# Altium schematic sheet Main_Connectors.SchDoc
size A; DocumentNumber: D_1; SheetNumber: 1; SheetTotal: 21
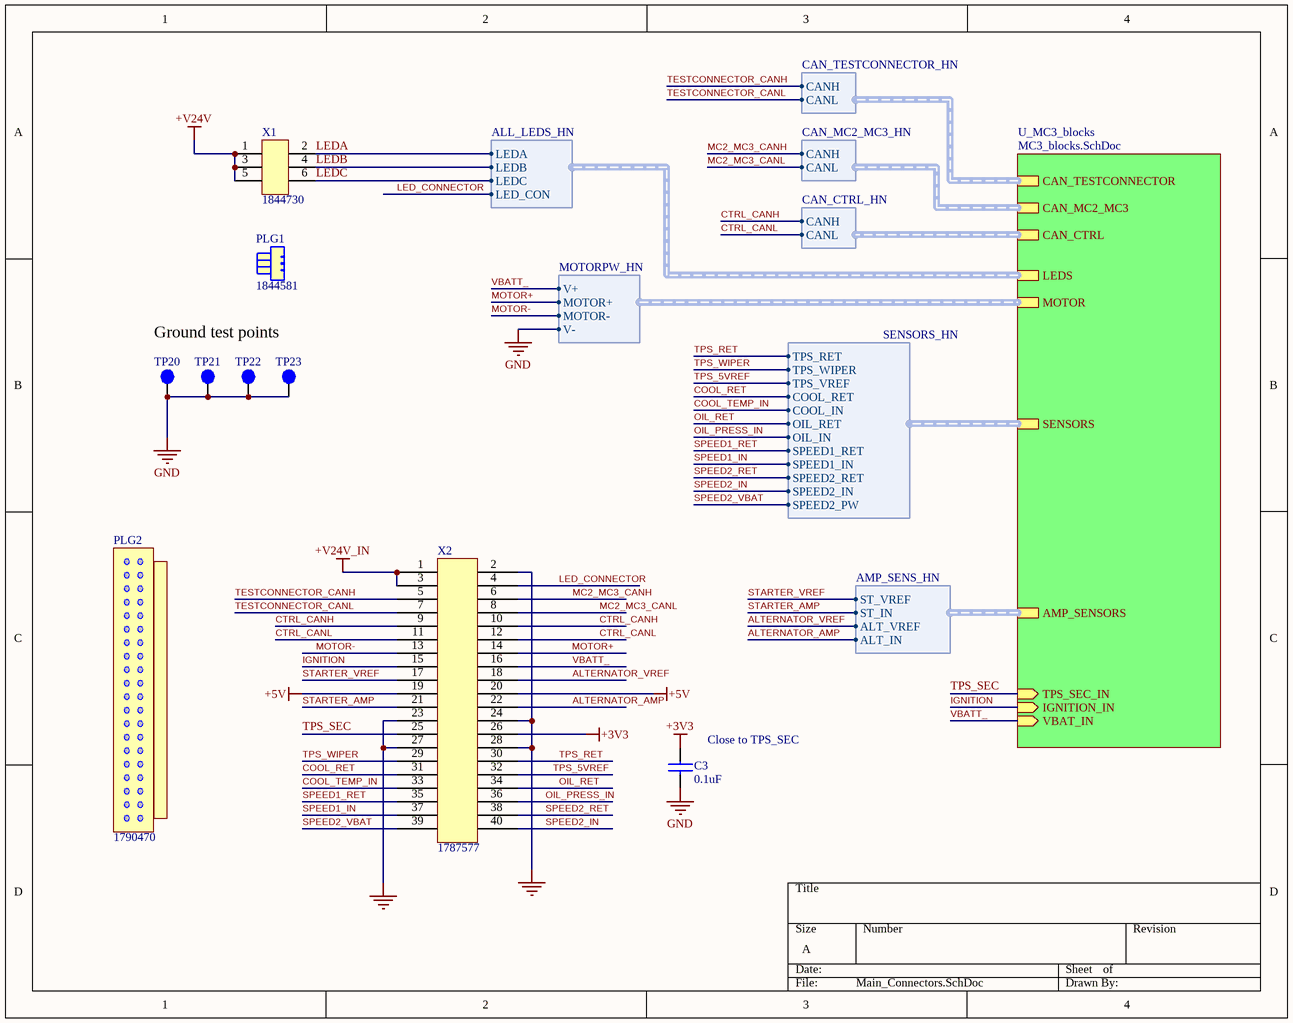
[diagram p0: Main_Connectors.SchDoc]

## Parts
C3  0.1uF  [C0805]
PLG1  1844581  (mechanical)
PLG2  1790470  (mechanical)
TP20  T  [TESTPOINTSMD_1x1MM]  (value not drawn)  (no BOM)
TP21  T  [TESTPOINTSMD_1x1MM]  (value not drawn)  (no BOM)
TP22  T  [TESTPOINTSMD_1x1MM]  (value not drawn)  (no BOM)
TP23  T  [TESTPOINTSMD_1x1MM]  (value not drawn)  (no BOM)
X1  1844730  [DMC 0,5/ 3-G1- 2,54 P20THR R24]
X2  1787577  [DMCV 1,5/20-G1F-3,5-LR P20THR]

## Sub-sheets
U_MC3_blocks = MC3_blocks.SchDoc: SENSORS (harness SENSORS_HN), CAN_TESTCONNECTOR (harness CAN_TESTCONNECTOR_HN), CAN_MC2_MC3 (harness CAN_MC2_MC3_HN), CAN_CTRL (harness CAN_CTRL_HN), LEDS (harness ALL_LEDS_HN), MOTOR (harness MOTORPW_HN), AMP_SENSORS (harness AMP_SENS_HN), TPS_SEC_IN (in), IGNITION_IN (in), VBAT_IN (in)

## Harnesses
CAN_TESTCONNECTOR_HN: CANH, CANL
CAN_MC2_MC3_HN: CANH, CANL
CAN_CTRL_HN: CANH, CANL
ALL_LEDS_HN: LEDA, LEDB, LEDC, LED_CON
MOTORPW_HN: V+, MOTOR+, MOTOR-, V-
SENSORS_HN: TPS_RET, TPS_WIPER, TPS_VREF, COOL_RET, COOL_IN, OIL_RET, OIL_IN, SPEED1_RET, SPEED1_IN, SPEED2_RET, SPEED2_IN, SPEED2_PW
AMP_SENS_HN: ST_VREF, ST_IN, ALT_VREF, ALT_IN

## Nets
+3V3: C3.1 X2.26
+5V: X2.19 X2.20
+V24V: X1.1 X1.3 X1.5
+V24V_IN: X2.1 X2.3
GND: C3.2 TP20.1 TP21.1 TP22.1 TP23.1 X2.2 X2.23 X2.24 X2.27 X2.28 ; sheet U_MC3_blocks/MOTOR.V-
ALTERNATOR_AMP: X2.22 ; sheet U_MC3_blocks/AMP_SENSORS.ALT_IN
ALTERNATOR_VREF: X2.18 ; sheet U_MC3_blocks/AMP_SENSORS.ALT_VREF
COOL_RET: X2.31 ; sheet U_MC3_blocks/SENSORS.COOL_RET
COOL_TEMP_IN: X2.33 ; sheet U_MC3_blocks/SENSORS.COOL_IN
CTRL_CANH: X2.9 X2.10 ; sheet U_MC3_blocks/CAN_CTRL.CANH
CTRL_CANL: X2.11 X2.12 ; sheet U_MC3_blocks/CAN_CTRL.CANL
IGNITION: X2.15 ; sheet U_MC3_blocks/IGNITION_IN
LED_CONNECTOR: X2.4 ; sheet U_MC3_blocks/LEDS.LED_CON
LEDA: X1.2 ; sheet U_MC3_blocks/LEDS.LEDA
LEDB: X1.4 ; sheet U_MC3_blocks/LEDS.LEDB
LEDC: X1.6 ; sheet U_MC3_blocks/LEDS.LEDC
MC2_MC3_CANH: X2.6 ; sheet U_MC3_blocks/CAN_MC2_MC3.CANH
MC2_MC3_CANL: X2.8 ; sheet U_MC3_blocks/CAN_MC2_MC3.CANL
MOTOR+: X2.14 ; sheet U_MC3_blocks/MOTOR.MOTOR+
MOTOR-: X2.13 ; sheet U_MC3_blocks/MOTOR.MOTOR-
OIL_PRESS_IN: X2.36 ; sheet U_MC3_blocks/SENSORS.OIL_IN
OIL_RET: X2.34 ; sheet U_MC3_blocks/SENSORS.OIL_RET
SPEED1_IN: X2.37 ; sheet U_MC3_blocks/SENSORS.SPEED1_IN
SPEED1_RET: X2.35 ; sheet U_MC3_blocks/SENSORS.SPEED1_RET
SPEED2_IN: X2.40 ; sheet U_MC3_blocks/SENSORS.SPEED2_IN
SPEED2_RET: X2.38 ; sheet U_MC3_blocks/SENSORS.SPEED2_RET
SPEED2_VBAT: X2.39 ; sheet U_MC3_blocks/SENSORS.SPEED2_PW
STARTER_AMP: X2.21 ; sheet U_MC3_blocks/AMP_SENSORS.ST_IN
STARTER_VREF: X2.17 ; sheet U_MC3_blocks/AMP_SENSORS.ST_VREF
TESTCONNECTOR_CANH: X2.5 ; sheet U_MC3_blocks/CAN_TESTCONNECTOR.CANH
TESTCONNECTOR_CANL: X2.7 ; sheet U_MC3_blocks/CAN_TESTCONNECTOR.CANL
TPS_5VREF: X2.32 ; sheet U_MC3_blocks/SENSORS.TPS_VREF
TPS_RET: X2.30 ; sheet U_MC3_blocks/SENSORS.TPS_RET
TPS_SEC: X2.25 ; sheet U_MC3_blocks/TPS_SEC_IN
TPS_WIPER: X2.29 ; sheet U_MC3_blocks/SENSORS.TPS_WIPER
VBATT_: X2.16 ; sheet U_MC3_blocks/VBAT_IN, sheet U_MC3_blocks/MOTOR.V+

## Notes on the sheet
- Ground test points
- (near C3) Close to TPS_SEC

## Library data of the parts
C3 = C0805C104K5RACTU: Cap Ceramic 0.1uF 50V X7R 10% SMD 2.0 x 1.2 mm 125 C Paper T/R; Manufacturer: KEMET; Capacitance: 100nF; Voltage: 500V; Supplier 1: Mouser; Supplier Part Number 1: 80-C0805C104K5R; Manufacturer Part Number: C0805C104K5RACTU; RoHS: Yes; Category: Ceramic Capacitors; Stock 1: 4177670; Pricing 1: 1=0.17000, 10=0.10400, 100=0.05600, 500=0.03900, 1000=0.03200, 4000=0.02400 (USD); Mount: Surface Mount,PCB; Case/Package: 0805; Number of Pins: 2; Case Code (Imperial): 0805; Case Code (Metric): 2012; Dielectric Material: Ceramic; Contact Plating: Tin,Matte; Min Operating Temperature: -55°C; Max Operating Temperature: 125°C; Voltage Rating: 50V; Tolerance: 10%; Packaging: Tape and Reel; Dielectric: X7R; Package Quantity: 4000; Voltage Rating (DC): 50V; Termination: SMD/SMT; Length: 2mm; Height: 0.9mm; Width: 1.2mm; Depth: 1.25mm; Thickness: 0.035inch; Lead Pitch: 0.75mm; Radiation Hardening: No; REACH SVHC: No SVHC; ComponentLink1URL: https://datasheet.ciiva.com/14589/70095383-14589048.pdf?src-supplier=Allied+Electronics; ComponentLink1Description: https://datasheet.ciiva.com/14589/70095383-14589048.pdf?src-supplier=Allied+Electronics; ComponentLink2URL: https://datasheet.ciiva.com/28682/1851736-28682232.pdf?src-supplier=Element14; ComponentLink2Description: https://datasheet.ciiva.com/28682/1851736-28682232.pdf?src-supplier=Element14; ComponentLink3URL: https://datasheet.ciiva.com/32431/slceramic-chip-condensers-e-32431755.pdf?src-supplier=Distrelec; ComponentLink3Description: https://datasheet.ciiva.com/32431/slceramic-chip-condensers-e-32431755.pdf?src-supplier=Distrelec; ComponentLink4URL: https://datasheet.ciiva.com/18410/70095383-18410815.pdf?src-supplier=Allied+Electronics; ComponentLink4Description: https://datasheet.ciiva.com/18410/70095383-18410815.pdf?src-supplier=Allied+Electronics
PLG1 = 1844581: Terminal block; plug; 6 positions; 0.100"(2.54mm) pitch; Screwless; 6A; 150V; Black; Manufacturer: Phoenix Contact; Number of Positions: 6; Number of Positions Per Level: 3; Number of Levels: 2; Pitch: 0.1inch; Wire Gauge (Max): 26AWG; Wire Gauge (Min): 20AWG; Supplier 1: Mouser; Supplier Part Number 1: 651-1844581; Manufacturer Part Number: 1844581; RoHS: Yes; Category: Terminal Blocks; Stock 1: 365; Pricing 1: 1=5.22000, 10=4.99000, 25=4.92000, 50=4.85000, 100=4.54000, 250=4.17000, 500=3.85000, 1000=3.67000, 2500=3.45000 (USD); Mount: Free Hanging; Number of Pins: 6; Color: Black; Contact Plating: Gold; Housing Color: Black; Packaging: Bulk; Termination: Screwless; Current: 6A; Voltage: 150V; ComponentLink1URL: https://media.digikey.com/pdf/Data%20Sheets/Phoenix%20Contact%20PDFs/1844581.pdf?src-supplier=Digi-Key; ComponentLink1Description: https://media.digikey.com/pdf/Data%20Sheets/Phoenix%20Contact%20PDFs/1844581.pdf?src-supplier=Digi-Key
PLG2 = 1790470: 40 position; 8A; 250V; Push-in;Terminal block; PCB; Plug; Female Sockets;; Manufacturer: Phoenix Contact; Number of Positions: 40; Number of Positions Per Level: 20; Number of Levels: 2; Voltage: 150V; Voltage Rating: 160V; Connector Type: Screw; Pitch: 0.138inch; Wire Gauge (Max): 16AWG; Wire Gauge (Min): 24AWG; Supplier 1: Mouser; Supplier Part Number 1: 651-1790470; Manufacturer Part Number: 1790470; RoHS: Yes; Category: Terminal Blocks; Stock 1: 94; Pricing 1: 1=32.15000, 10=31.27000, 25=30.47000, 50=29.22000, 100=26.89000, 250=24.84000 (USD); Mount: Free Hanging; Color: Green; Contact Plating: Tin; Housing Color: Green; Housing Material: Plastic; Package Quantity: 1; Termination: Screwless; Current: 8A; Current Rating: 8A; Packaging: Bulk; ComponentLink1URL: https://datasheet.ciiva.com/15056/1790470-15056229.pdf?src-supplier=Digi-Key; ComponentLink1Description: https://datasheet.ciiva.com/15056/1790470-15056229.pdf?src-supplier=Digi-Key; ComponentLink2URL: https://datasheet.ciiva.com/14913/1790470-14913096.pdf?src-supplier=Arrow+Electronics; ComponentLink2Description: https://datasheet.ciiva.com/14913/1790470-14913096.pdf?src-supplier=Arrow+Electronics; ComponentLink3URL: https://datasheet.ciiva.com/818/1790470-818583.pdf?src-supplier=Digi-Key; ComponentLink3Description: https://datasheet.ciiva.com/818/1790470-818583.pdf?src-supplier=Digi-Key
TP20-TP23 = TestPoint_SMD_1x1: SMD Test Point
X1 = 1844730: Terminal block; Header; Male Pins; (4 Side); 6 pos; 0.100"(2.54mm) pitch; 6A; 150V; Manufacturer: Phoenix Contact; Number of Positions: 6; Number of Positions Per Level: 3; Number of Levels: 2; Supplier 1: Mouser; Supplier Part Number 1: 651-1844730; Manufacturer Part Number: 1844730; RoHS: No; Category: Terminal Blocks; Stock 1: 975; Pricing 1: 1=3.31000, 10=3.17000, 50=3.03000, 100=2.95000, 250=2.75000, 500=2.54000 (USD); Mount: Through Hole; Number of Pins: 6; Color: Black; Contact Plating: Gold; Packaging: Tape and Reel; Termination: Solder; Current: 6A; Voltage: 150V; ComponentLink1URL: https://media.digikey.com/pdf/Data%20Sheets/Phoenix%20Contact%20PDFs/1844730.pdf?src-supplier=Digi-Key; ComponentLink1Description: https://media.digikey.com/pdf/Data%20Sheets/Phoenix%20Contact%20PDFs/1844730.pdf?src-supplier=Digi-Key
X2 = 1787577: 40 pins PCB header Phoenix Contact 1787577 Contact spacing: 3.50 mm; Current Rating: 8A; Connector Type: Plug; Number of Positions: 20; Number of Levels: 2; Voltage: 150V; Voltage Rating: 160V; Pitch: 0.138inch; Supplier 1: Mouser; Manufacturer: Phoenix Contact; Manufacturer Part Number: 1787577; RoHS: Yes; Category: Terminal Blocks; Stock 1: 89; Pricing 1: 1=14.81000, 10=14.41000, 25=14.04000, 50=13.46000, 100=12.39000, 250=11.45000 (USD); Mount: Through Hole; Contact Plating: Tin; Color: Black; Contact Material: Tin; Housing Color: Black; Package Quantity: 50; Packaging: Bulk; Number of Rows: 2; Termination: Solder; Number of Positions Per Level: 20; Current: 8A; Orientation: Vertical; Length: 10.6mm; Height: 12mm; Width: 77mm; ComponentLink1URL: https://datasheet.ciiva.com/817/1787577-817976.pdf?src-supplier=Digi-Key; ComponentLink1Description: https://datasheet.ciiva.com/817/1787577-817976.pdf?src-supplier=Digi-Key; ComponentLink2URL: https://datasheet.ciiva.com/29212/772230-da-01-de-grundgehaeuse-1787577-50-st-29212411.pdf?src-supplier=Conrad; ComponentLink2Description: https://datasheet.ciiva.com/29212/772230-da-01-de-grundgehaeuse-1787577-50-st-29212411.pdf?src-supplier=Conrad; Supplier Part Number 1: 651-1787577